# Altium schematic sheet McuOverview.SchDoc
size A; SheetNumber: 11; SheetTotal: 14
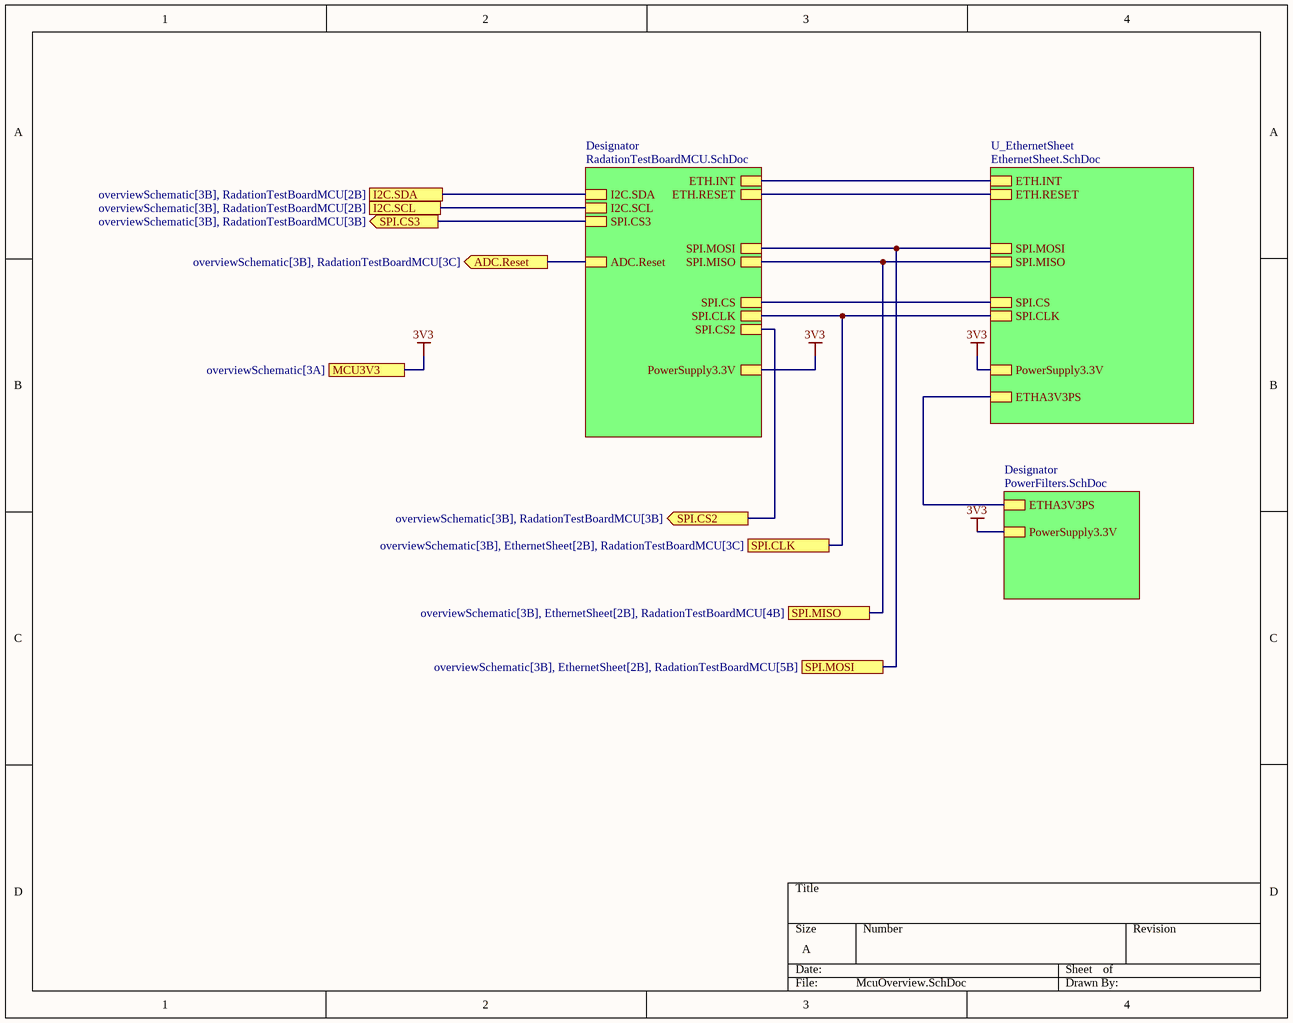
[diagram p0: McuOverview.SchDoc]

## Sub-sheets
Designator = RadationTestBoardMCU.SchDoc: I2C.SDA, I2C.SCL, SPI.MISO, SPI.CLK, ETH.INT, SPI.MOSI, SPI.CS, ETH.RESET, PowerSupply3.3V, SPI.CS2, SPI.CS3, ADC.Reset
Designator = PowerFilters.SchDoc: PowerSupply3.3V, ETHA3V3PS
U_EthernetSheet = EthernetSheet.SchDoc: ETH.INT, SPI.MOSI, SPI.MISO, SPI.CLK, SPI.CS, ETH.RESET, PowerSupply3.3V, ETHA3V3PS

## Ports
ADC.Reset (out, see overviewSchematic[3B], RadationTestBoardMCU[3C]), I2C.SCL (see overviewSchematic[3B], RadationTestBoardMCU[2B]), I2C.SDA (see overviewSchematic[3B], RadationTestBoardMCU[2B]), MCU3V3 (see overviewSchematic[3A]), SPI.CLK (see overviewSchematic[3B], EthernetSheet[2B], RadationTestBoardMCU[3C]), SPI.CS2 (out, see overviewSchematic[3B], RadationTestBoardMCU[3B]), SPI.CS3 (out, see overviewSchematic[3B], RadationTestBoardMCU[3B]), SPI.MISO (see overviewSchematic[3B], EthernetSheet[2B], RadationTestBoardMCU[4B]), SPI.MOSI (see overviewSchematic[3B], EthernetSheet[2B], RadationTestBoardMCU[5B])

## Nets
3V3: port MCU3V3, sheet U_EthernetSheet/PowerSupply3.3V, sheet Designator/PowerSupply3.3V, sheet Designator/PowerSupply3.3V
ADC.Reset: port ADC.Reset, sheet Designator/ADC.Reset
I2C.SCL: port I2C.SCL, sheet Designator/I2C.SCL
I2C.SDA: port I2C.SDA, sheet Designator/I2C.SDA
SPI.CLK: port SPI.CLK, sheet U_EthernetSheet/SPI.CLK, sheet Designator/SPI.CLK
SPI.CS2: port SPI.CS2, sheet Designator/SPI.CS2
SPI.CS3: port SPI.CS3, sheet Designator/SPI.CS3
SPI.MISO: port SPI.MISO, sheet U_EthernetSheet/SPI.MISO, sheet Designator/SPI.MISO
SPI.MOSI: port SPI.MOSI, sheet U_EthernetSheet/SPI.MOSI, sheet Designator/SPI.MOSI
(unnamed): sheet U_EthernetSheet/ETH.INT, sheet Designator/ETH.INT
(unnamed): sheet U_EthernetSheet/SPI.CS, sheet Designator/SPI.CS
(unnamed): sheet U_EthernetSheet/ETH.RESET, sheet Designator/ETH.RESET
(unnamed): sheet U_EthernetSheet/ETHA3V3PS, sheet Designator/ETHA3V3PS